# Altium project ezDSPExpansionRev2Project.PrjPCB
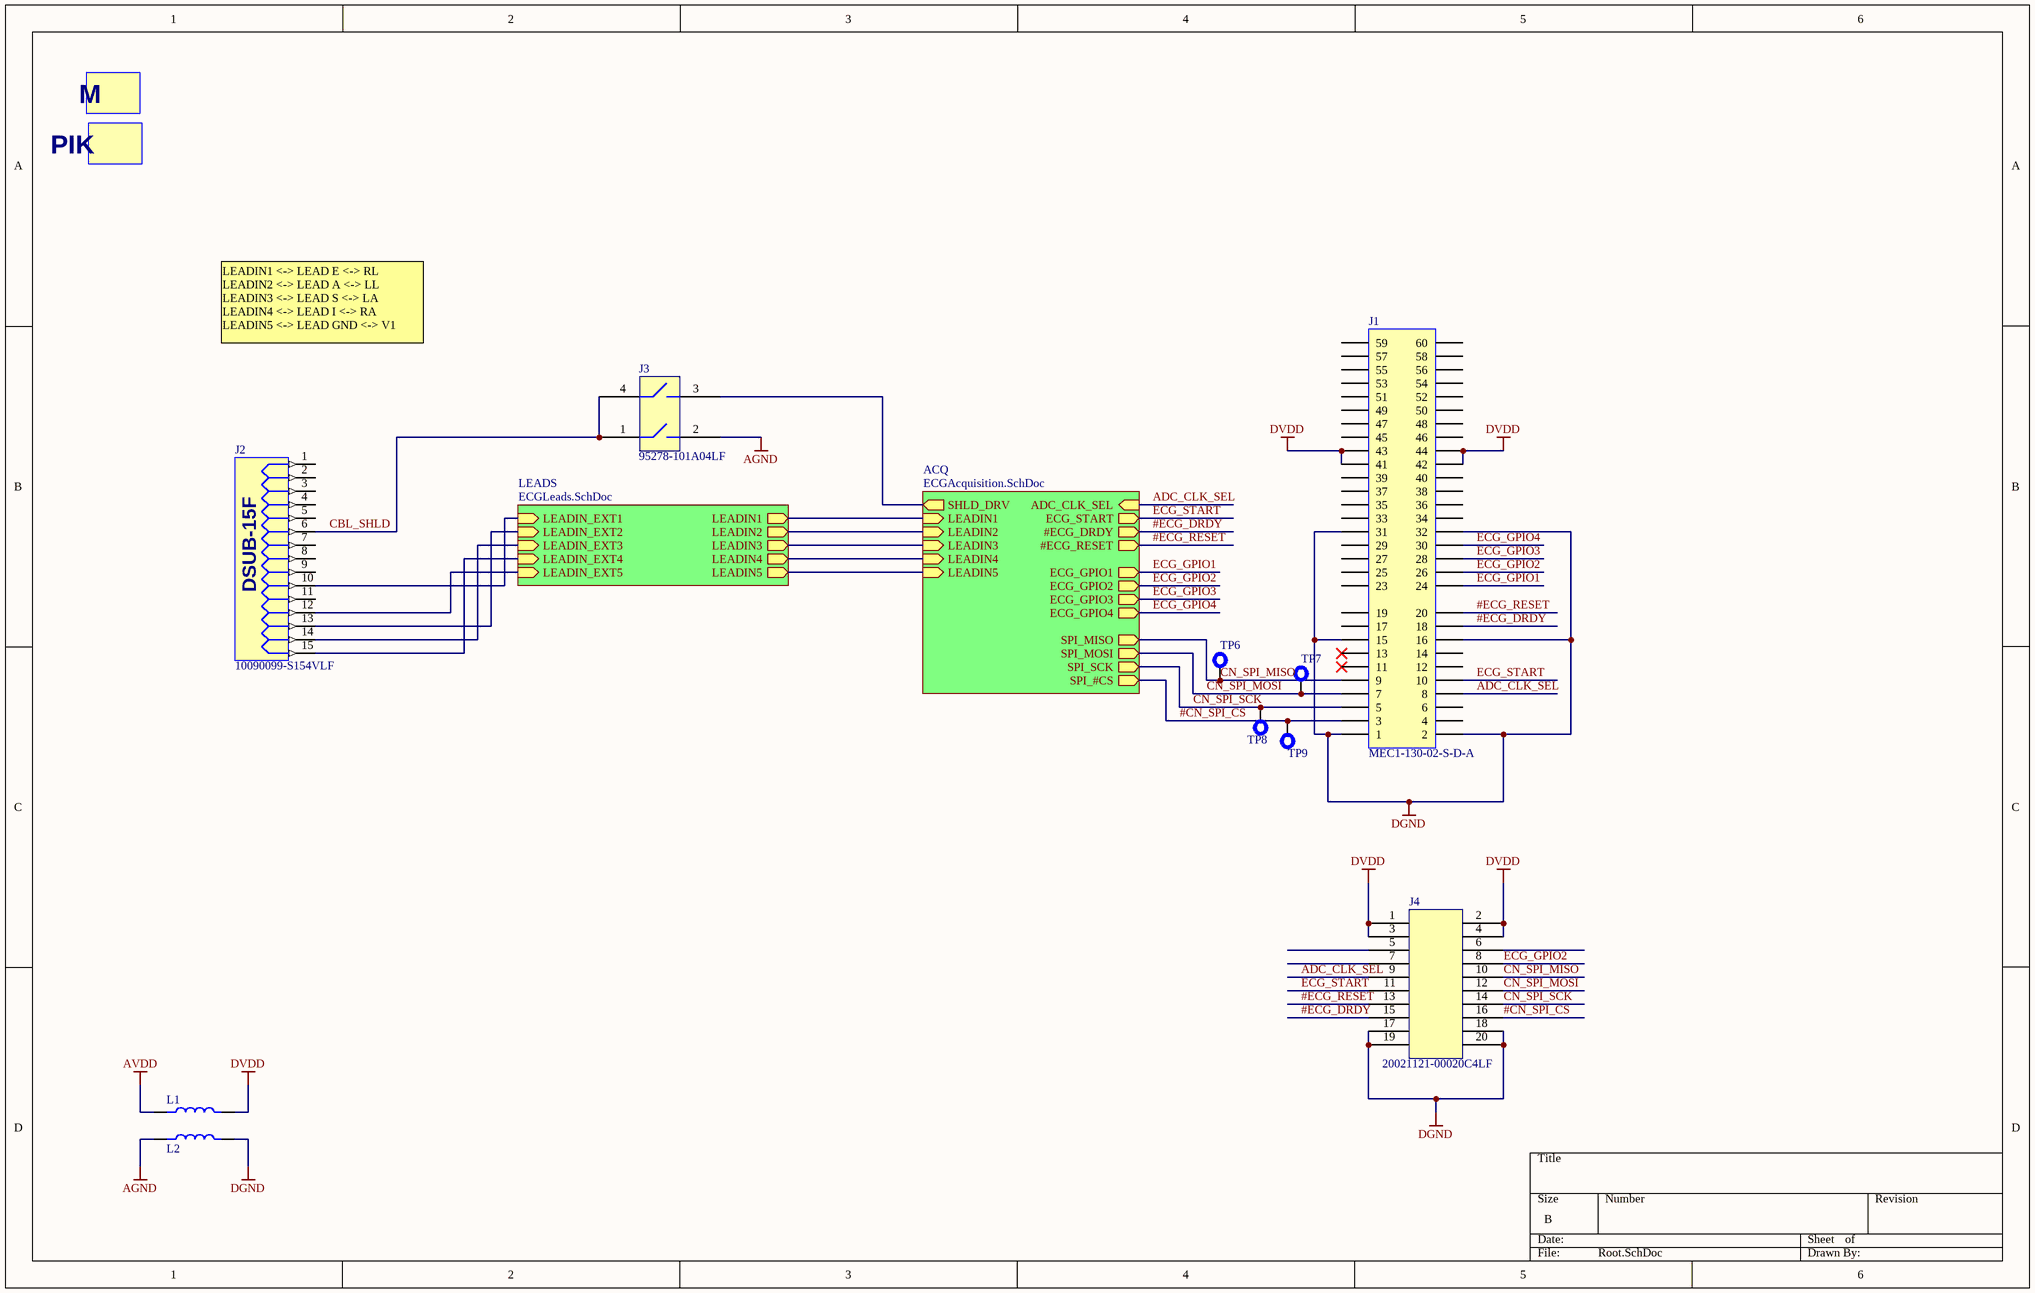
[diagram p0: Root.SchDoc]
4 sheets, 78 parts. Net scope: hierarchical (ports join the sheet entries above them; power ports are global).
Board file: ExpansionBoard.PcbDoc
Sheets:
  Root.SchDoc
    LEADS = ECGLeads.SchDoc
      ESD1 = LeadESDProtection.SchDoc
      ESD2 = LeadESDProtection.SchDoc
      ESD3 = LeadESDProtection.SchDoc
      ESD4 = LeadESDProtection.SchDoc
      ESD5 = LeadESDProtection.SchDoc
    ACQ = ECGAcquisition.SchDoc

## Sheet Root.SchDoc
size B

### Parts
J1  MEC1-130-02-S-D-A  [MEC1-130-02-S-D-A]
J2  10090099-S154VLF  [10090099-S154VLF]
J3  95278-101A04LF  [95278-101A04LF]
J4  20021121-00020C4LF  [20021121-00020C4LF]
L1  IND_GEN  [IND_0603]  (value not drawn)
L2  IND_GEN  [IND_0603]  (value not drawn)
OV1  MINNESOTA_OVERLAY  [Minnesota]  (value not drawn)
OV2  PIKACHU_OVERLAY  [PIKACHU]  (value not drawn)
TP6  TEST_PT_40MIL  [TP_40MIL]  (value not drawn)
TP7  TEST_PT_40MIL  [TP_40MIL]  (value not drawn)
TP8  TEST_PT_40MIL  [TP_40MIL]  (value not drawn)
TP9  TEST_PT_40MIL  [TP_40MIL]  (value not drawn)

### Sub-sheets
ACQ = ECGAcquisition.SchDoc: SPI_MISO (out), SPI_SCK (out), SPI_#CS (out), SPI_MOSI (out), ADC_CLK_SEL (in), ECG_START (out), #ECG_DRDY (out), #ECG_RESET (out), ECG_GPIO1 (out), ECG_GPIO2 (out), ECG_GPIO3 (out), ECG_GPIO4 (out), LEADIN2 (in), LEADIN3 (in), LEADIN4 (in), LEADIN1 (in), LEADIN5 (in), SHLD_DRV (out)
LEADS = ECGLeads.SchDoc: LEADIN_EXT1 (in), LEADIN_EXT2 (in), LEADIN_EXT3 (in), LEADIN_EXT4 (in), LEADIN_EXT5 (in), LEADIN1 (out), LEADIN2 (out), LEADIN3 (out), LEADIN4 (out), LEADIN5 (out)

### Nets
AGND: J3.2 L2.1
AVDD: L1.1
DGND: J1.1 J1.2 J1.15 J1.16 J1.31 J1.32 J4.17 J4.18 J4.19 J4.20 L2.2
DVDD: J1.41 J1.42 J1.43 J1.44 J4.1 J4.2 J4.3 J4.4 L1.2
#CN_SPI_CS: J1.3 J4.16 TP9.1 ; sheet ACQ/SPI_#CS
#ECG_DRDY: J1.18 J4.15 ; sheet ACQ/#ECG_DRDY
#ECG_RESET: J1.20 J4.13 ; sheet ACQ/#ECG_RESET
ADC_CLK_SEL: J1.8 J4.9 ; sheet ACQ/ADC_CLK_SEL
CBL_SHLD: J2.6 J3.1 J3.4
CN_SPI_MISO: J1.9 J4.10 TP6.1 ; sheet ACQ/SPI_MISO
CN_SPI_MOSI: J1.7 J4.12 TP7.1 ; sheet ACQ/SPI_MOSI
CN_SPI_SCK: J1.5 J4.14 TP8.1 ; sheet ACQ/SPI_SCK
ECG_GPIO1: J1.24 ; sheet ACQ/ECG_GPIO1
ECG_GPIO2: J1.26 J4.8 ; sheet ACQ/ECG_GPIO2
ECG_GPIO3: J1.28 ; sheet ACQ/ECG_GPIO3
ECG_GPIO4: J1.30 ; sheet ACQ/ECG_GPIO4
ECG_START: J1.10 J4.11 ; sheet ACQ/ECG_START
LEADIN1: sheet LEADS/LEADIN1, sheet ACQ/LEADIN1
LEADIN2: sheet LEADS/LEADIN2, sheet ACQ/LEADIN2
LEADIN3: sheet LEADS/LEADIN3, sheet ACQ/LEADIN3
LEADIN4: sheet LEADS/LEADIN4, sheet ACQ/LEADIN4
LEADIN5: sheet LEADS/LEADIN5, sheet ACQ/LEADIN5
LEADIN_EXT1: J2.10 ; sheet LEADS/LEADIN_EXT1
LEADIN_EXT2: J2.13 ; sheet LEADS/LEADIN_EXT2
LEADIN_EXT3: J2.14 ; sheet LEADS/LEADIN_EXT3
LEADIN_EXT4: J2.15 ; sheet LEADS/LEADIN_EXT4
LEADIN_EXT5: J2.12 ; sheet LEADS/LEADIN_EXT5
NetJ3_3: J3.3 ; sheet ACQ/SHLD_DRV

Not connected (* = marked no-connect by the designer): J1 4 6 11* 12 13* 14 17 19 23 25 27 29 33 34 35 36 37 38 39 40 45 46 47 48 49 50 51 52 53 54 55 56 57 58 59 60; J2 1 2 3 4 5 7 8 9 11; J4 5(3) 6(4) 7(4)

### Notes on the sheet
- LEADIN1 <-> LEAD E <-> RL
  LEADIN2 <-> LEAD A <-> LL
  LEADIN3 <-> LEAD S <-> LA
  LEADIN4 <-> LEAD I <-> RA
  LEADIN5 <-> LEAD GND <-> V1
- (in symbol 10090099-S154VLF) DSUB-15F
- (in symbol MINNESOTA_OVERLAY) M
- (in symbol PIKACHU_OVERLAY) PIK

### Library data of the parts
J1 = MEC1-130-02-S-D-A: CONN EDGE CARD DL 1MM 60POS SMD; Manufacturer: Samtec; Manufacturer Part Number: MEC1-130-02-S-D-A
J2 = 10090099-S154VLF: CONN DSUB RCPT 15POS R/A GOLD; Manufacturer: FCI; Manufacturer Part Number: 10090099-S154VLF
J3 = 95278-101A04LF: CONN HEADER 4POS .100" DL SMD; Manufacturer: FCI; Manufacturer Part Number: 95278-101A04LF
J4 = 20021121-00020C4LF: CONN HEADER 20POS DL UNSHRD SMD; Manufacturer: FCI; Manufacturer Part Number: 20021121-00020C4LF
L1 L2 = IND_GEN: Generic Inductor; Manufacturer: TDK Corporation; Manufacturer Part Number: MPZ1608Y151B; Value: ?
OV1 = MINNESOTA_OVERLAY: UOFM OVERLAY
OV2 = PIKACHU_OVERLAY: PIKACHU BOTTOM OVERLAY
TP6-TP9 = TEST_PT_40MIL: 40MIL DIAM TEST POINT

## Sheet ECGLeads.SchDoc
size B
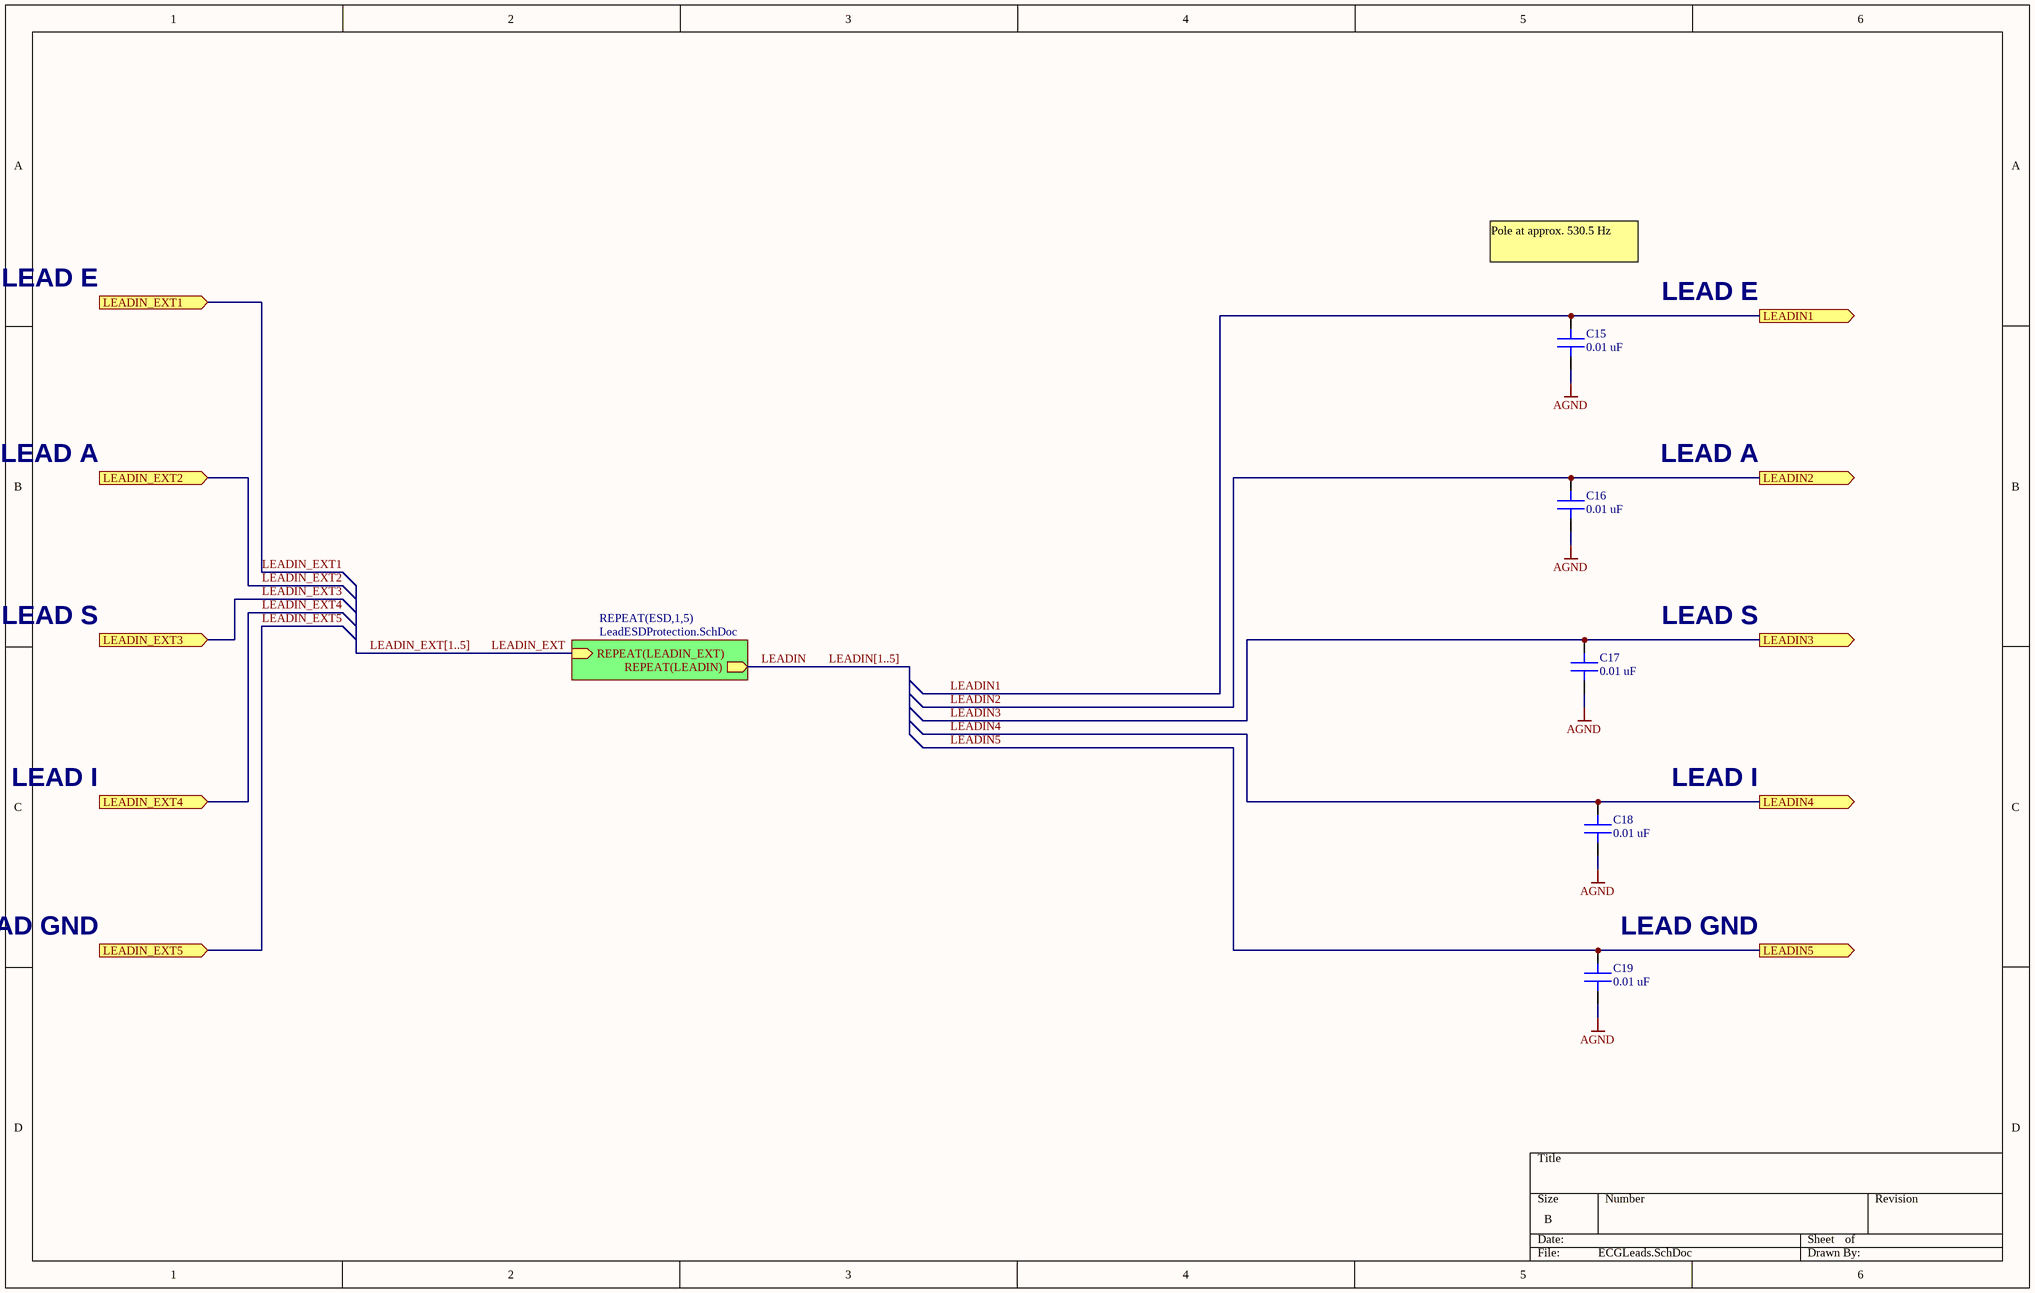
[diagram p1: ECGLeads.SchDoc]

### Parts
C15  value 0.01 uF  [CAP_0603]  (hidden comment: CAP CER 1200PF 50V 10% X7R 0603)
C16  value 0.01 uF  [CAP_0603]  (hidden comment: CAP CER 1200PF 50V 10% X7R 0603)
C17  value 0.01 uF  [CAP_0603]  (hidden comment: CAP CER 1200PF 50V 10% X7R 0603)
C18  value 0.01 uF  [CAP_0603]  (hidden comment: CAP CER 1200PF 50V 10% X7R 0603)
C19  value 0.01 uF  [CAP_0603]  (hidden comment: CAP CER 1200PF 50V 10% X7R 0603)

### Sub-sheets
REPEAT(ESD,1,5) = LeadESDProtection.SchDoc: REPEAT(LEADIN_EXT) (in), REPEAT(LEADIN) (out)

### Ports
LEADIN1 (out), LEADIN2 (out), LEADIN3 (out), LEADIN4 (out), LEADIN5 (out), LEADIN_EXT1 (in), LEADIN_EXT2 (in), LEADIN_EXT3 (in), LEADIN_EXT4 (in), LEADIN_EXT5 (in)

### Nets
AGND: C15.1 C16.1 C17.1 C18.1 C19.1
LEADIN: sheet REPEAT(ESD,1,5)/REPEAT(LEADIN)
LEADIN1: C15.2 ; port LEADIN1
LEADIN2: C16.2 ; port LEADIN2
LEADIN3: C17.2 ; port LEADIN3
LEADIN4: C18.2 ; port LEADIN4
LEADIN5: C19.2 ; port LEADIN5
LEADIN_EXT: sheet REPEAT(ESD,1,5)/REPEAT(LEADIN_EXT)

### Buses and harness runs
bus LEADIN[1..5]
bus LEADIN_EXT[1..5]

### Notes on the sheet
- LEAD E
- Pole at approx. 530.5 Hz
- LEAD A
- LEAD S
- LEAD I
- LEAD GND

### Library data of the parts
C15 C17-C19 = CAP_GEN: CAP CER 10000PF 50V 10% X7R 0603; Manufacturer: TDK Corporation; Manufacturer Part Number: C1608X7R1H103K080AA
C16 = CAP_GEN: CAP CER 10000PF 50V 10% X7R 0603

## Sheet LeadESDProtection.SchDoc
size B
Used 5 times, as channels LEADS/ESD1, LEADS/ESD2, LEADS/ESD3, LEADS/ESD4, LEADS/ESD5. Parts and nets are listed once, with the designators drawn on the sheet.
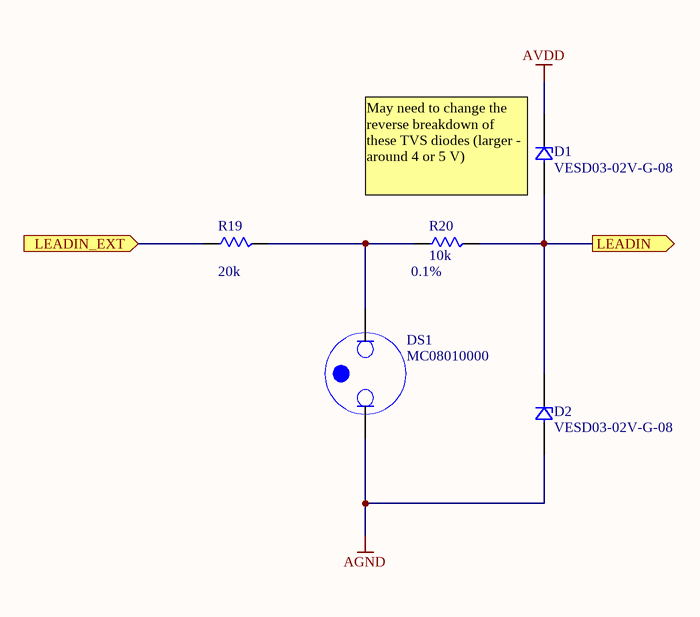
[diagram p2: LeadESDProtection.SchDoc]

### Parts
D1  VESD03-02V-G-08  [SOD-523]
D2  VESD03-02V-G-08  [SOD-523]
DS1  MC08010000  [MC08010000]
R19  value 20k  [RES_MELF_0207]  (hidden comment: RES_GEN)
R20  value 10k  Precision: 0.1%  [RES_0805_PW]  (hidden comment: RES_GEN)

### Ports
LEADIN (out), LEADIN_EXT (in)

### Nets
AGND: D2.1 DS1.1
AVDD: D1.2
LEADIN: D1.1 D2.2 R20.2 ; port LEADIN
LEADIN_EXT: R19.1 ; port LEADIN_EXT
NetDS1_2: DS1.2 R19.2 R20.1

### Channels
LEADS/ESD1: designators end in _ESD1; ports LEADIN=LEADIN1 LEADIN_EXT=LEADIN_EXT1
LEADS/ESD2: designators end in _ESD2; ports LEADIN=LEADIN2 LEADIN_EXT=LEADIN_EXT2
LEADS/ESD3: designators end in _ESD3; ports LEADIN=LEADIN3 LEADIN_EXT=LEADIN_EXT3
LEADS/ESD4: designators end in _ESD4; ports LEADIN=LEADIN4 LEADIN_EXT=LEADIN_EXT4
LEADS/ESD5: designators end in _ESD5; ports LEADIN=LEADIN5 LEADIN_EXT=LEADIN_EXT5

### Notes on the sheet
- (near D1) May need to change the reverse breakdown of these TVS diodes (larger - around 4 or 5 V)

### Library data of the parts
D1 D2 = VESD03-02V-G-08: TVS DIODE 3V 108W SOD523; Manufacturer: Vishay Semiconductors; Manufacturer Part Number: VESD03-02V-G-08
DS1 = MC08010000: LAMP, NEON, T-1 1/4, WIRE; Manufacturer: Multicomp; Manufacturer Part Number: MC08010000
R19 = RES_GEN: RES 20K OHM 1W 2% 0207 MELF; Manufacturer: Vishay Beyschlag; Manufacturer Part Number: CMB02070X2002GB200; Package: MELF 0207
R20 = RES_GEN: RES 10K OHM 1/4W 0.1% 0805; Manufacturer: TT Electronics; Manufacturer Part Number: PFC-W0805LF-03-1002-B-1739

## Sheet ECGAcquisition.SchDoc
size B
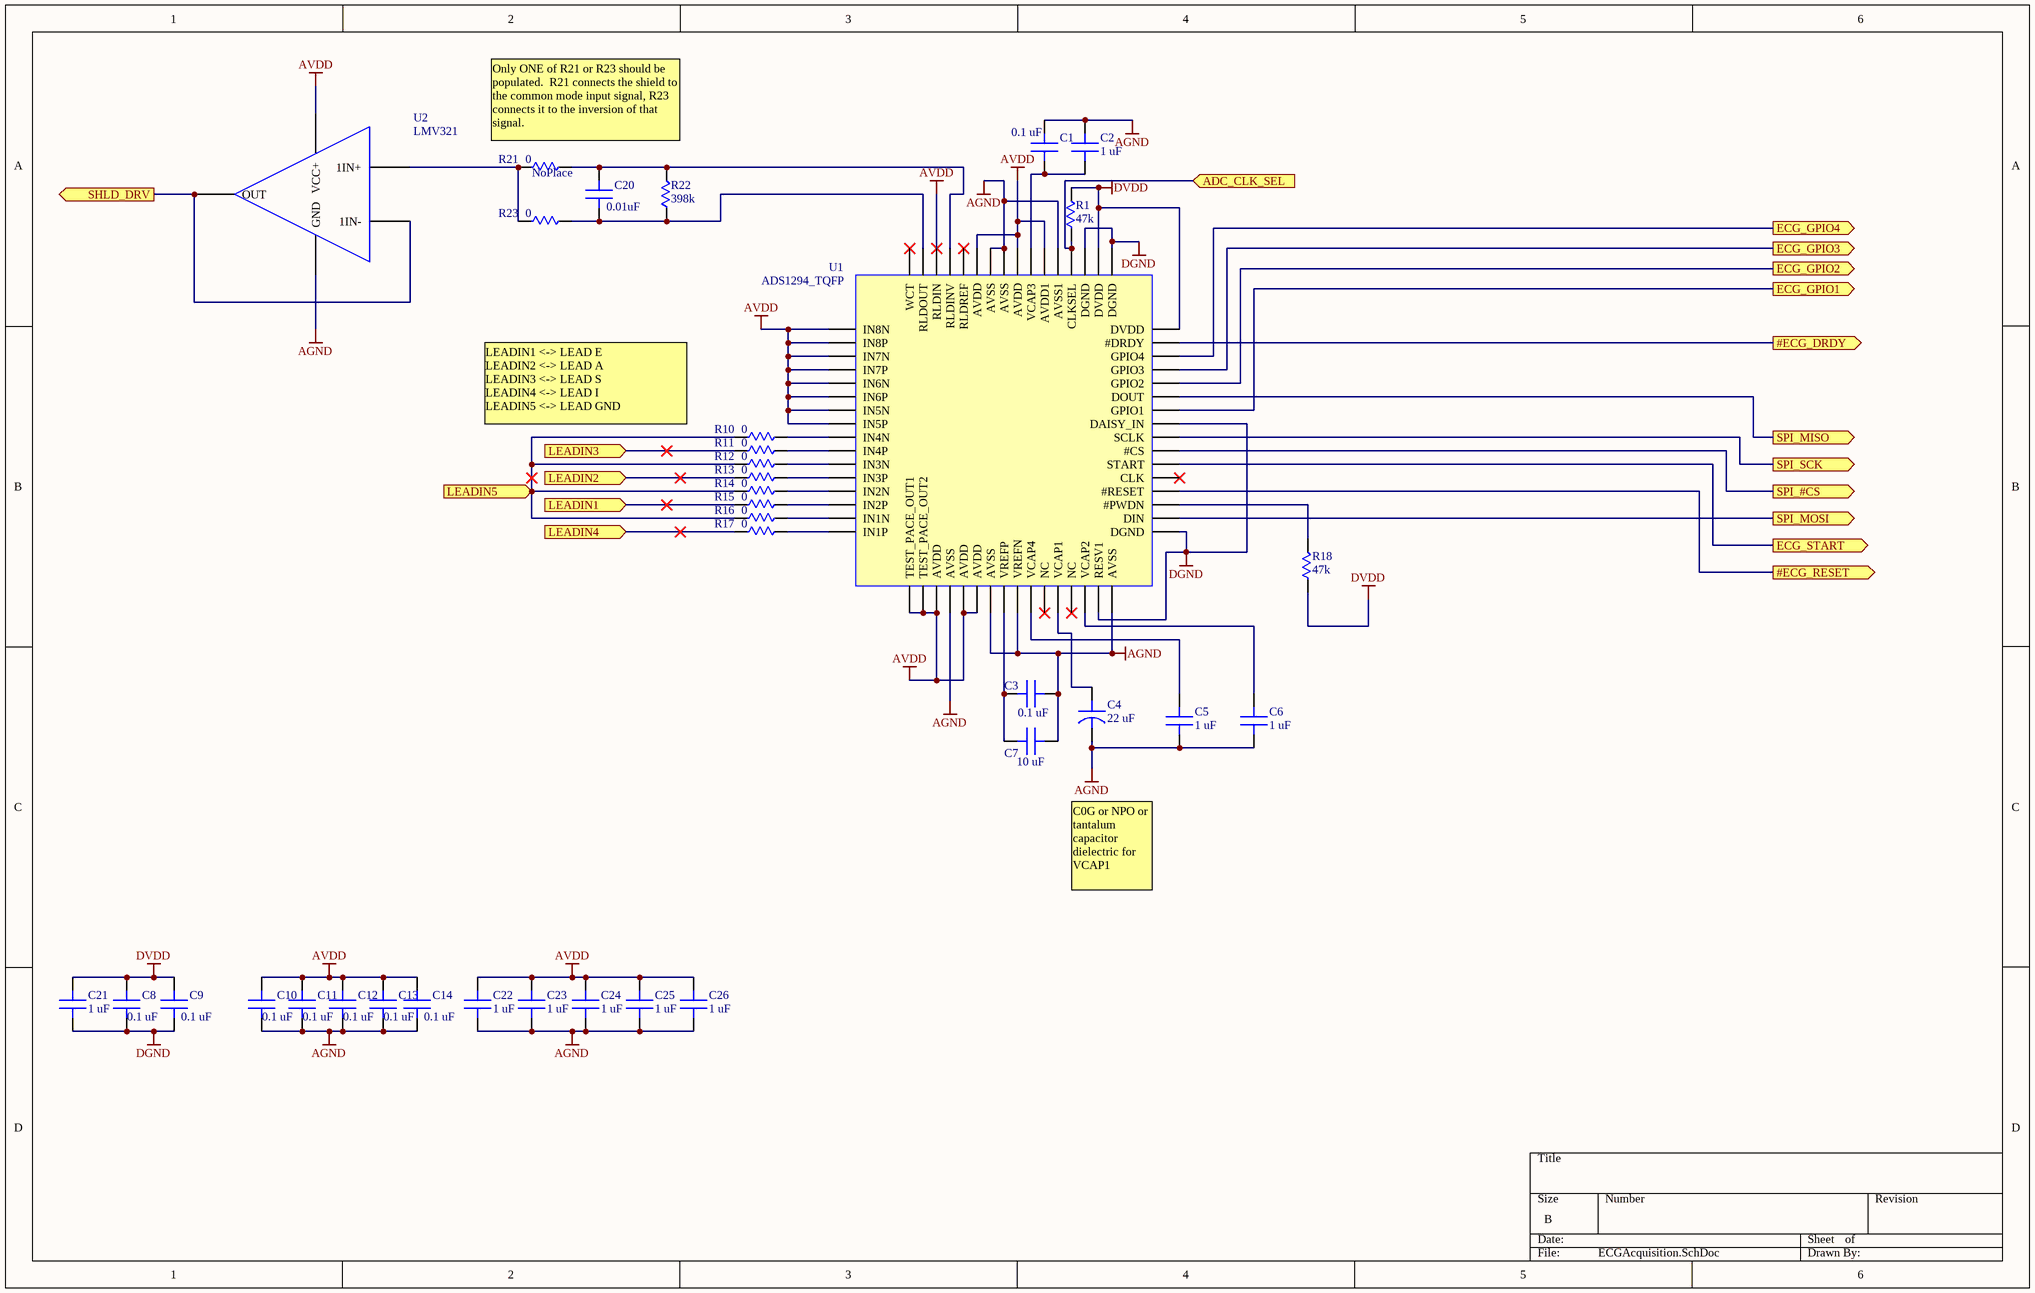
[diagram p3: ECGAcquisition.SchDoc]

### Parts
C1  value 0.1 uF  [CAP_0603]  (hidden comment: CAP_GEN)
C2  value 1 uF  [CAP_0603]  (hidden comment: CAP_GEN)
C3  value 0.1 uF  [CAP_0603]  (hidden comment: CAP_GEN)
C4  value 22 uF  [CAP_0603_POLAR]  (hidden comment: CAP_GEN_POLAR)
C5  value 1 uF  [CAP_0603]  (hidden comment: CAP_GEN)
C6  value 1 uF  [CAP_0603]  (hidden comment: CAP_GEN)
C7  value 10 uF  [CAP_0603]  (hidden comment: CAP_GEN)
C8  value 0.1 uF  [CAP_0603]  (hidden comment: CAP_GEN)
C9  value 0.1 uF  [CAP_0603]  (hidden comment: CAP_GEN)
C10  value 0.1 uF  [CAP_0603]  (hidden comment: CAP_GEN)
C11  value 0.1 uF  [CAP_0603]  (hidden comment: CAP_GEN)
C12  value 0.1 uF  [CAP_0603]  (hidden comment: CAP_GEN)
C13  value 0.1 uF  [CAP_0603]  (hidden comment: CAP_GEN)
C14  value 0.1 uF  [CAP_0603]  (hidden comment: CAP_GEN)
C20  value 0.01uF  [CAP_0603]  (hidden comment: CAP_GEN)
C21  value 1 uF  [CAP_0603]  (hidden comment: CAP_GEN)
C22  value 1 uF  [CAP_0603]  (hidden comment: CAP_GEN)
C23  value 1 uF  [CAP_0603]  (hidden comment: CAP_GEN)
C24  value 1 uF  [CAP_0603]  (hidden comment: CAP_GEN)
C25  value 1 uF  [CAP_0603]  (hidden comment: CAP_GEN)
C26  value 1 uF  [CAP_0603]  (hidden comment: CAP_GEN)
R1  value 47k  [RES_0603]  (hidden comment: RES_GEN)
R10  value 0  [RES_0603]  (hidden comment: RES_GEN)
R11  value 0  [RES_0603]  (hidden comment: RES_GEN)
R12  value 0  [RES_0603]  (hidden comment: RES_GEN)
R13  value 0  [RES_0603]  (hidden comment: RES_GEN)
R14  value 0  [RES_0603]  (hidden comment: RES_GEN)
R15  value 0  [RES_0603]  (hidden comment: RES_GEN)
R16  value 0  [RES_0603]  (hidden comment: RES_GEN)
R17  value 0  [RES_0603]  (hidden comment: RES_GEN)
R18  value 47k  [RES_0603]  (hidden comment: RES_GEN)
R21  value 0  NoPlace?: NoPlace  [RES_0603]  (hidden comment: RES_GEN)
R22  value 398k  [RES_0603]  (hidden comment: RES_GEN)
R23  value 0  [RES_0603]  (hidden comment: RES_GEN)
U1  ADS1294_TQFP  [TQFP_64_HD]
U2  LMV321  [SOT23_5]

### Ports
#ECG_DRDY (out), #ECG_RESET (out), ADC_CLK_SEL (in), ECG_GPIO1 (out), ECG_GPIO2 (out), ECG_GPIO3 (out), ECG_GPIO4 (out), ECG_START (out), LEADIN1 (in), LEADIN2 (in), LEADIN3 (in), LEADIN4 (in), LEADIN5 (in), SHLD_DRV (out), SPI_#CS (out), SPI_MISO (out), SPI_MOSI (out), SPI_SCK (out)

### Nets
AGND: C1.2 C2.2 C3.1 C4.2 C5.1 C6.1 C7.1 C10.1 C11.1 C12.1 C13.1 C14.1 C22.1 C23.1 C24.1 C25.1 C26.1 U1.20(AVSS) U1.23(AVSS) U1.25(VREFN) U1.32(AVSS) U1.53(AVSS1) U1.57(AVSS) U1.58(AVSS) U2.2(GND)
AVDD: C10.2 C11.2 C12.2 C13.2 C14.2 C22.2 C23.2 C24.2 C25.2 C26.2 U1.1(IN8N) U1.2(IN8P) U1.3(IN7N) U1.4(IN7P) U1.5(IN6N) U1.6(IN6P) U1.7(IN5N) U1.8(IN5P) U1.17(TEST_PACE_OUT1) U1.18(TEST_PACE_OUT2) U1.19(AVDD) U1.21(AVDD) U1.22(AVDD) U1.54(AVDD1) U1.56(AVDD) U1.59(AVDD) U1.62(RLDIN) U2.5(VCC+)
DGND: C8.1 C9.1 C21.1 U1.31(RESV1) U1.33(DGND) U1.41(DAISY_IN) U1.49(DGND) U1.51(DGND)
DVDD: C8.2 C9.2 C21.2 R1.2 R18.1 U1.48(DVDD) U1.50(DVDD)
#CN_SPI_CS: U1.39(#CS) ; port SPI_#CS
#ECG_DRDY: U1.47(#DRDY) ; port #ECG_DRDY
#ECG_RESET: U1.36(#RESET) ; port #ECG_RESET
ADC_CLK_SEL: R1.1 U1.52(CLKSEL) ; port ADC_CLK_SEL
CN_SPI_MISO: U1.43(DOUT) ; port SPI_MISO
CN_SPI_MOSI: U1.34(DIN) ; port SPI_MOSI
CN_SPI_SCK: U1.40(SCLK) ; port SPI_SCK
ECG_GPIO1: U1.42(GPIO1) ; port ECG_GPIO1
ECG_GPIO2: U1.44(GPIO2) ; port ECG_GPIO2
ECG_GPIO3: U1.45(GPIO3) ; port ECG_GPIO3
ECG_GPIO4: U1.46(GPIO4) ; port ECG_GPIO4
ECG_START: U1.38(START) ; port ECG_START
LEADIN1: R15.1 ; port LEADIN1
LEADIN2: R13.1 ; port LEADIN2
LEADIN3: R11.1 ; port LEADIN3
LEADIN4: R17.1 ; port LEADIN4
LEADIN5: R10.1 R12.1 R14.1 R16.1 ; port LEADIN5
NetC1_1: C1.1 C2.1 U1.55(VCAP3)
NetC3_2: C3.2 C7.2 U1.24(VREFP)
NetC4_1: C4.1 U1.28(VCAP1)
NetC5_2: C5.2 U1.26(VCAP4)
NetC6_2: C6.2 U1.30(VCAP2)
NetC20_1: C20.1 R22.1 R23.2 U1.63(RLDOUT)
NetC20_2: C20.2 R21.2 R22.2 U1.61(RLDINV)
NetJ3_3: U2.3(1IN-) U2.4(OUT) ; port SHLD_DRV
NetR10_2: R10.2 U1.9(IN4N)
NetR11_2: R11.2 U1.10(IN4P)
NetR12_2: R12.2 U1.11(IN3N)
NetR13_2: R13.2 U1.12(IN3P)
NetR14_2: R14.2 U1.13(IN2N)
NetR15_2: R15.2 U1.14(IN2P)
NetR16_2: R16.2 U1.15(IN1N)
NetR17_2: R17.2 U1.16(IN1P)
NetR18_2: R18.2 U1.35(#PWDN)
NetR21_1: R21.1 R23.1 U2.1(1IN+)

Not connected (* = marked no-connect by the designer): U1 27(NC)* 29(NC)* 37(CLK)* 60(RLDREF)* 64(WCT)*

### Notes on the sheet
- Only ONE of R21 or R23 should be populated.  R21 connects the shield to the common mode input signal, R23 connects it to the inversion of that signal.
- LEADIN1 <-> LEAD E
  LEADIN2 <-> LEAD A
  LEADIN3 <-> LEAD S
  LEADIN4 <-> LEAD I
  LEADIN5 <-> LEAD GND
- C0G or NPO or tantalum capacitor dielectric for VCAP1

### Library data of the parts
C1 C3 C8-C14 = CAP_GEN: Generic Capacitor; Manufacturer: Yageo; Manufacturer Part Number: CC0603ZRY5V9BB104
C2 C5 C6 = CAP_GEN: CAP CER 1UF 10V Y5V 0603; Manufacturer: TDK Corporation; Manufacturer Part Number: C1608Y5V1A105Z
C4 = CAP_GEN_POLAR: CAP TANT 22UF 6.3V 20% 0603; Manufacturer: Nichicon; Manufacturer Part Number: F980J226MMA
C7 = CAP_GEN: CAP CER 10UF 6.3V 20% X5R 0603; Manufacturer: Yageo; Manufacturer Part Number: CC0603MRX5R5BB106
C20 = CAP_GEN: as C15 on sheet ECGLeads
C21-C26 = CAP_GEN: CAP CER 1UF 10V 10% X5R 0603; Manufacturer: TDK Corporation; Manufacturer Part Number: C1608X5R1A105K080AC
R1 R18 = RES_GEN: RES 47K OHM 1/10W 5% 0603 SMD; Manufacturer: Yageo; Manufacturer Part Number: RC0603JR-0747KL
R10-R17 R21 R23 = RES_GEN: RES 0.0 OHM 0.1W JUMPER 0603 SMD; Manufacturer: Bourns Inc; Manufacturer Part Number: CR0603-J/-000ELF
R22 = RES_GEN: Generic Resistor; Manufacturer: ?; Manufacturer Part Number: ?
U1 = ADS1294_TQFP: IC AFE 24BIT 32KSPS 4CH 64TQFP; Manufacturer: Texas Instruments; Manufacturer Part Number: ADS1294IPAG
U2 = LMV321: IC OPAMP GP R-R 1MHZ SGL SOT23-5; Manufacturer: Texas Instruments; Manufacturer Part Number: LMV321IDBVR

## Nets that join several sheets
AGND: Root (J3.2 L2.1), ECGLeads (5 pins), LEADS/ESD1 (D2_ESD1.1 DS1_ESD1.1), LEADS/ESD2 (D2_ESD2.1 DS1_ESD2.1), LEADS/ESD3 (D2_ESD3.1 DS1_ESD3.1), LEADS/ESD4 (D2_ESD4.1 DS1_ESD4.1), LEADS/ESD5 (D2_ESD5.1 DS1_ESD5.1), ECGAcquisition (25 pins)
AVDD: Root (L1.1), LEADS/ESD1 (D1_ESD1.2), LEADS/ESD2 (D1_ESD2.2), LEADS/ESD3 (D1_ESD3.2), LEADS/ESD4 (D1_ESD4.2), LEADS/ESD5 (D1_ESD5.2), ECGAcquisition (28 pins)
DGND: Root (11 pins), ECGAcquisition (8 pins)
DVDD: Root (9 pins), ECGAcquisition (7 pins)
#CN_SPI_CS: Root (J1.3 J4.16 TP9.1), ECGAcquisition (U1.39)
#ECG_DRDY: Root (J1.18 J4.15), ECGAcquisition (U1.47)
#ECG_RESET: Root (J1.20 J4.13), ECGAcquisition (U1.36)
ADC_CLK_SEL: Root (J1.8 J4.9), ECGAcquisition (R1.1 U1.52)
CN_SPI_MISO: Root (J1.9 J4.10 TP6.1), ECGAcquisition (U1.43)
CN_SPI_MOSI: Root (J1.7 J4.12 TP7.1), ECGAcquisition (U1.34)
CN_SPI_SCK: Root (J1.5 J4.14 TP8.1), ECGAcquisition (U1.40)
ECG_GPIO1: Root (J1.24), ECGAcquisition (U1.42)
ECG_GPIO2: Root (J1.26 J4.8), ECGAcquisition (U1.44)
ECG_GPIO3: Root (J1.28), ECGAcquisition (U1.45)
ECG_GPIO4: Root (J1.30), ECGAcquisition (U1.46)
ECG_START: Root (J1.10 J4.11), ECGAcquisition (U1.38)
LEADIN1: ECGLeads (C15.2), LEADS/ESD1 (D1_ESD1.1 D2_ESD1.2 R20_ESD1.2), ECGAcquisition (R15.1)
LEADIN2: ECGLeads (C16.2), LEADS/ESD2 (D1_ESD2.1 D2_ESD2.2 R20_ESD2.2), ECGAcquisition (R13.1)
LEADIN3: ECGLeads (C17.2), LEADS/ESD3 (D1_ESD3.1 D2_ESD3.2 R20_ESD3.2), ECGAcquisition (R11.1)
LEADIN4: ECGLeads (C18.2), LEADS/ESD4 (D1_ESD4.1 D2_ESD4.2 R20_ESD4.2), ECGAcquisition (R17.1)
LEADIN5: ECGLeads (C19.2), LEADS/ESD5 (D1_ESD5.1 D2_ESD5.2 R20_ESD5.2), ECGAcquisition (R10.1 R12.1 R14.1 R16.1)
LEADIN_EXT1: Root (J2.10), LEADS/ESD1 (R19_ESD1.1)
LEADIN_EXT2: Root (J2.13), LEADS/ESD2 (R19_ESD2.1)
LEADIN_EXT3: Root (J2.14), LEADS/ESD3 (R19_ESD3.1)
LEADIN_EXT4: Root (J2.15), LEADS/ESD4 (R19_ESD4.1)
LEADIN_EXT5: Root (J2.12), LEADS/ESD5 (R19_ESD5.1)
NetJ3_3: Root (J3.3), ECGAcquisition (U2.3 U2.4)